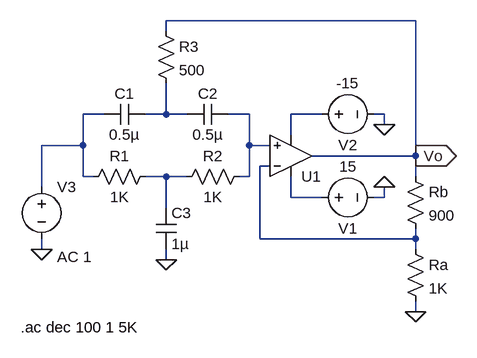
[diagram p0: schematic Run_4.asc]
Run_4.asc, the LTspice schematic file:
Version 4
SHEET 1 880 680
WIRE 64 -144 -320 -144
WIRE -320 -128 -320 -144
WIRE -416 0 -448 0
WIRE -320 0 -320 -48
WIRE -320 0 -352 0
WIRE -288 0 -320 0
WIRE -192 0 -224 0
WIRE -80 0 -128 0
WIRE 16 0 0 0
WIRE 16 16 16 0
WIRE -128 32 -128 0
WIRE -448 48 -448 0
WIRE -448 48 -512 48
WIRE -192 48 -192 0
WIRE -160 48 -192 48
WIRE 64 64 64 -144
WIRE 64 64 -96 64
WIRE -160 80 -176 80
WIRE -448 96 -448 48
WIRE -432 96 -448 96
WIRE -320 96 -352 96
WIRE -288 96 -320 96
WIRE -192 96 -192 48
WIRE -192 96 -208 96
WIRE 64 96 64 64
WIRE -512 112 -512 48
WIRE -128 128 -128 96
WIRE -80 128 -128 128
WIRE 16 128 16 112
WIRE 16 128 0 128
WIRE -320 144 -320 96
WIRE -176 192 -176 80
WIRE 64 192 64 176
WIRE 64 192 -176 192
WIRE -512 208 -512 192
WIRE 64 208 64 192
WIRE -320 224 -320 208
WIRE 64 304 64 288
FLAG 16 112 0
FLAG 16 16 0
FLAG -512 208 0
FLAG -320 224 0
FLAG 64 304 0
FLAG 64 64 Vo
IOPIN 64 64 Out
SYMBOL OpAmps\\UniversalOpamp2 -128 64 M180
SYMATTR InstName U1
SYMBOL voltage -96 128 M90
WINDOW 0 32 56 VTop 2
WINDOW 3 -32 56 VBottom 2
WINDOW 123 0 0 Left 0
WINDOW 39 0 0 Left 0
SYMATTR InstName V1
SYMATTR Value 15
SYMBOL voltage -96 0 M90
WINDOW 0 32 56 VTop 2
WINDOW 3 -32 56 VBottom 2
WINDOW 123 0 0 Left 0
WINDOW 39 0 0 Left 0
SYMATTR InstName V2
SYMATTR Value -15
SYMBOL cap -352 -16 R90
WINDOW 0 0 32 VBottom 2
WINDOW 3 32 32 VTop 2
SYMATTR InstName C1
SYMATTR Value 0.5µ
SYMBOL cap -224 -16 R90
WINDOW 0 0 32 VBottom 2
WINDOW 3 32 32 VTop 2
SYMATTR InstName C2
SYMATTR Value 0.5µ
SYMBOL res -336 80 R90
WINDOW 0 0 56 VBottom 2
WINDOW 3 32 56 VTop 2
SYMATTR InstName R1
SYMATTR Value 1K
SYMBOL res -192 80 R90
WINDOW 0 0 56 VBottom 2
WINDOW 3 32 56 VTop 2
SYMATTR InstName R2
SYMATTR Value 1K
SYMBOL voltage -512 96 R0
WINDOW 123 24 124 Left 2
WINDOW 39 0 0 Left 0
SYMATTR Value2 AC 1
SYMATTR InstName V3
SYMATTR Value ""
SYMBOL cap -336 144 R0
SYMATTR InstName C3
SYMATTR Value 1µ
SYMBOL res -336 -144 R0
SYMATTR InstName R3
SYMATTR Value 500
SYMBOL res 48 80 R0
SYMATTR InstName Rb
SYMATTR Value 900
SYMBOL res 48 192 R0
SYMATTR InstName Ra
SYMATTR Value 1K
TEXT -544 328 Left 2 !.ac dec 100 1 5K

The netlist it stands for:
* Run_4.asc
XU1 N003 N005 N007 N004 Vo level.2 Avol=1Meg GBW=10Meg Slew=10Meg ilimit=25m rail=0 Vos=0 phimargin=45 en=0 enk=0 in=0 ink=0 Rin=500Meg  ; pins IN+ IN- V+ V- OUT
V1 N007 0 15
V2 N004 0 -15
C1 N002 N001 0.5µ
C2 N003 N002 0.5µ
R1 N006 N001 1K
R2 N003 N006 1K
V3 N001 0 AC 1
C3 N006 0 1µ
R3 Vo N002 500
Rb Vo N005 900
Ra N005 0 1K
.ac dec 100 1 5K
.lib UniversalOpamps2.sub
.backanno
.end